# Altium schematic sheet Main.SchDoc
size 635 x 279 mm; SheetNumber: 1
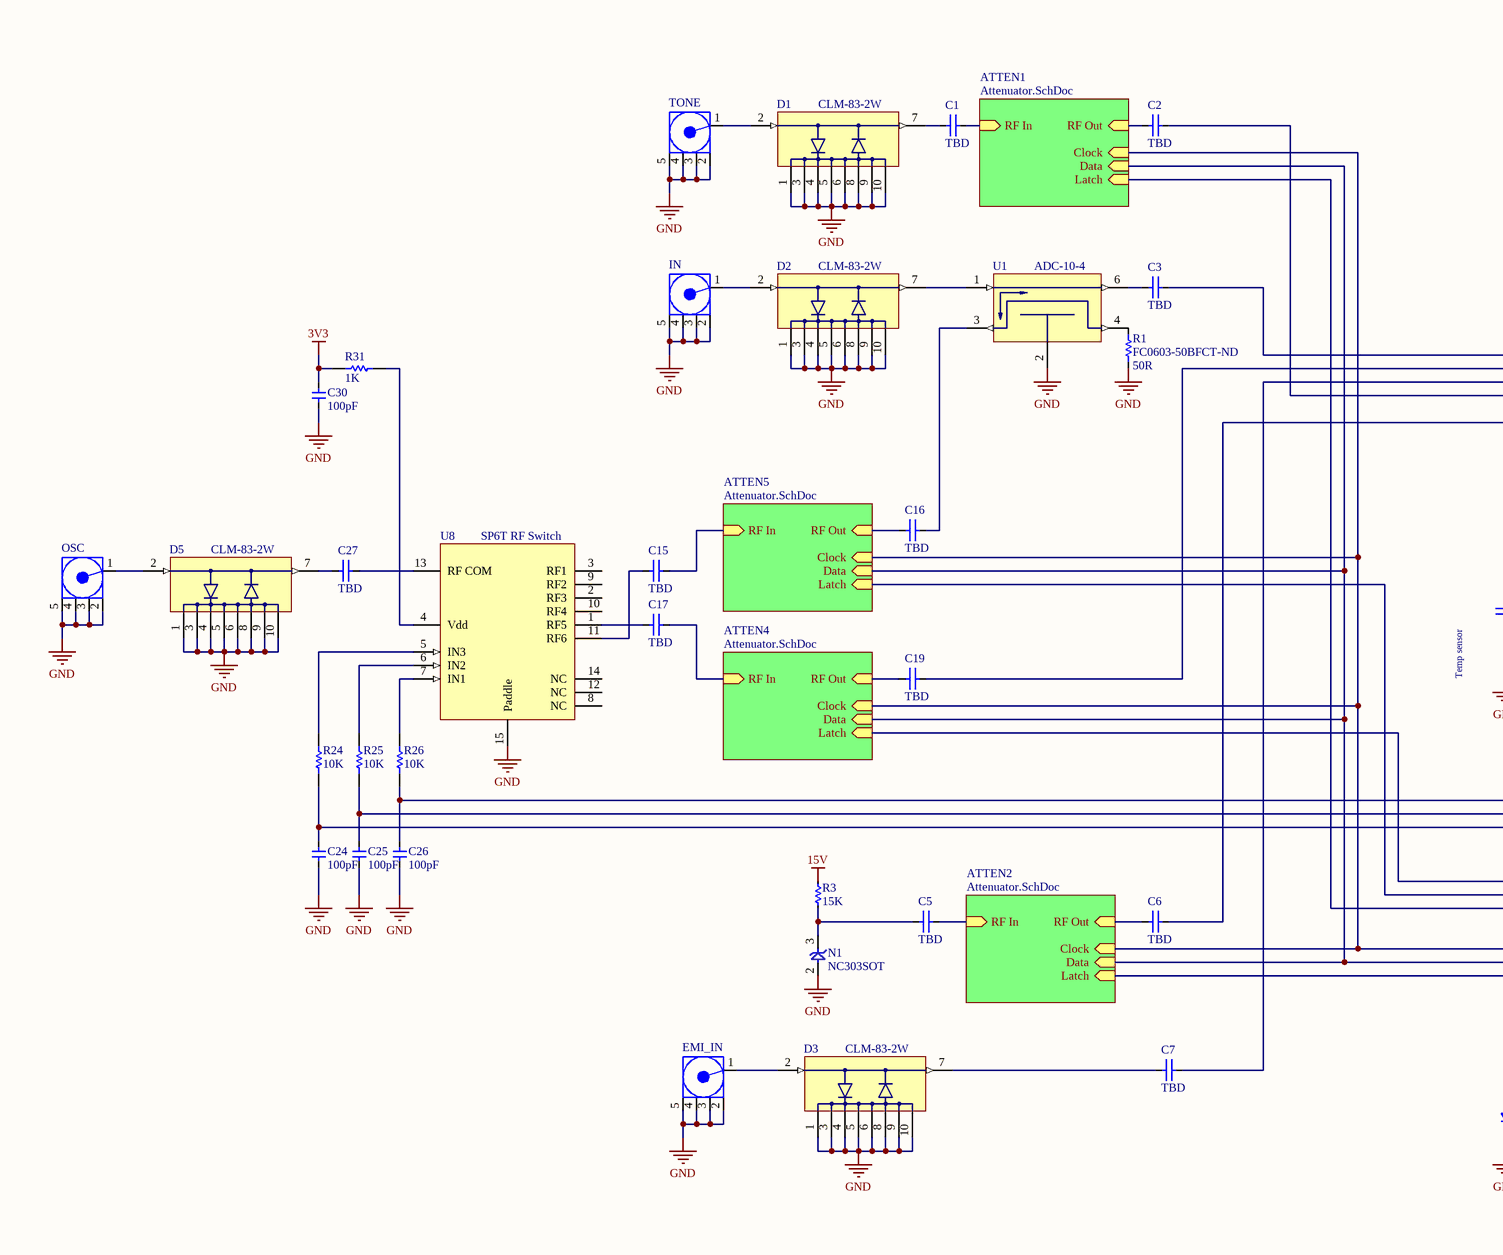
[diagram p0: Main.SchDoc, left]
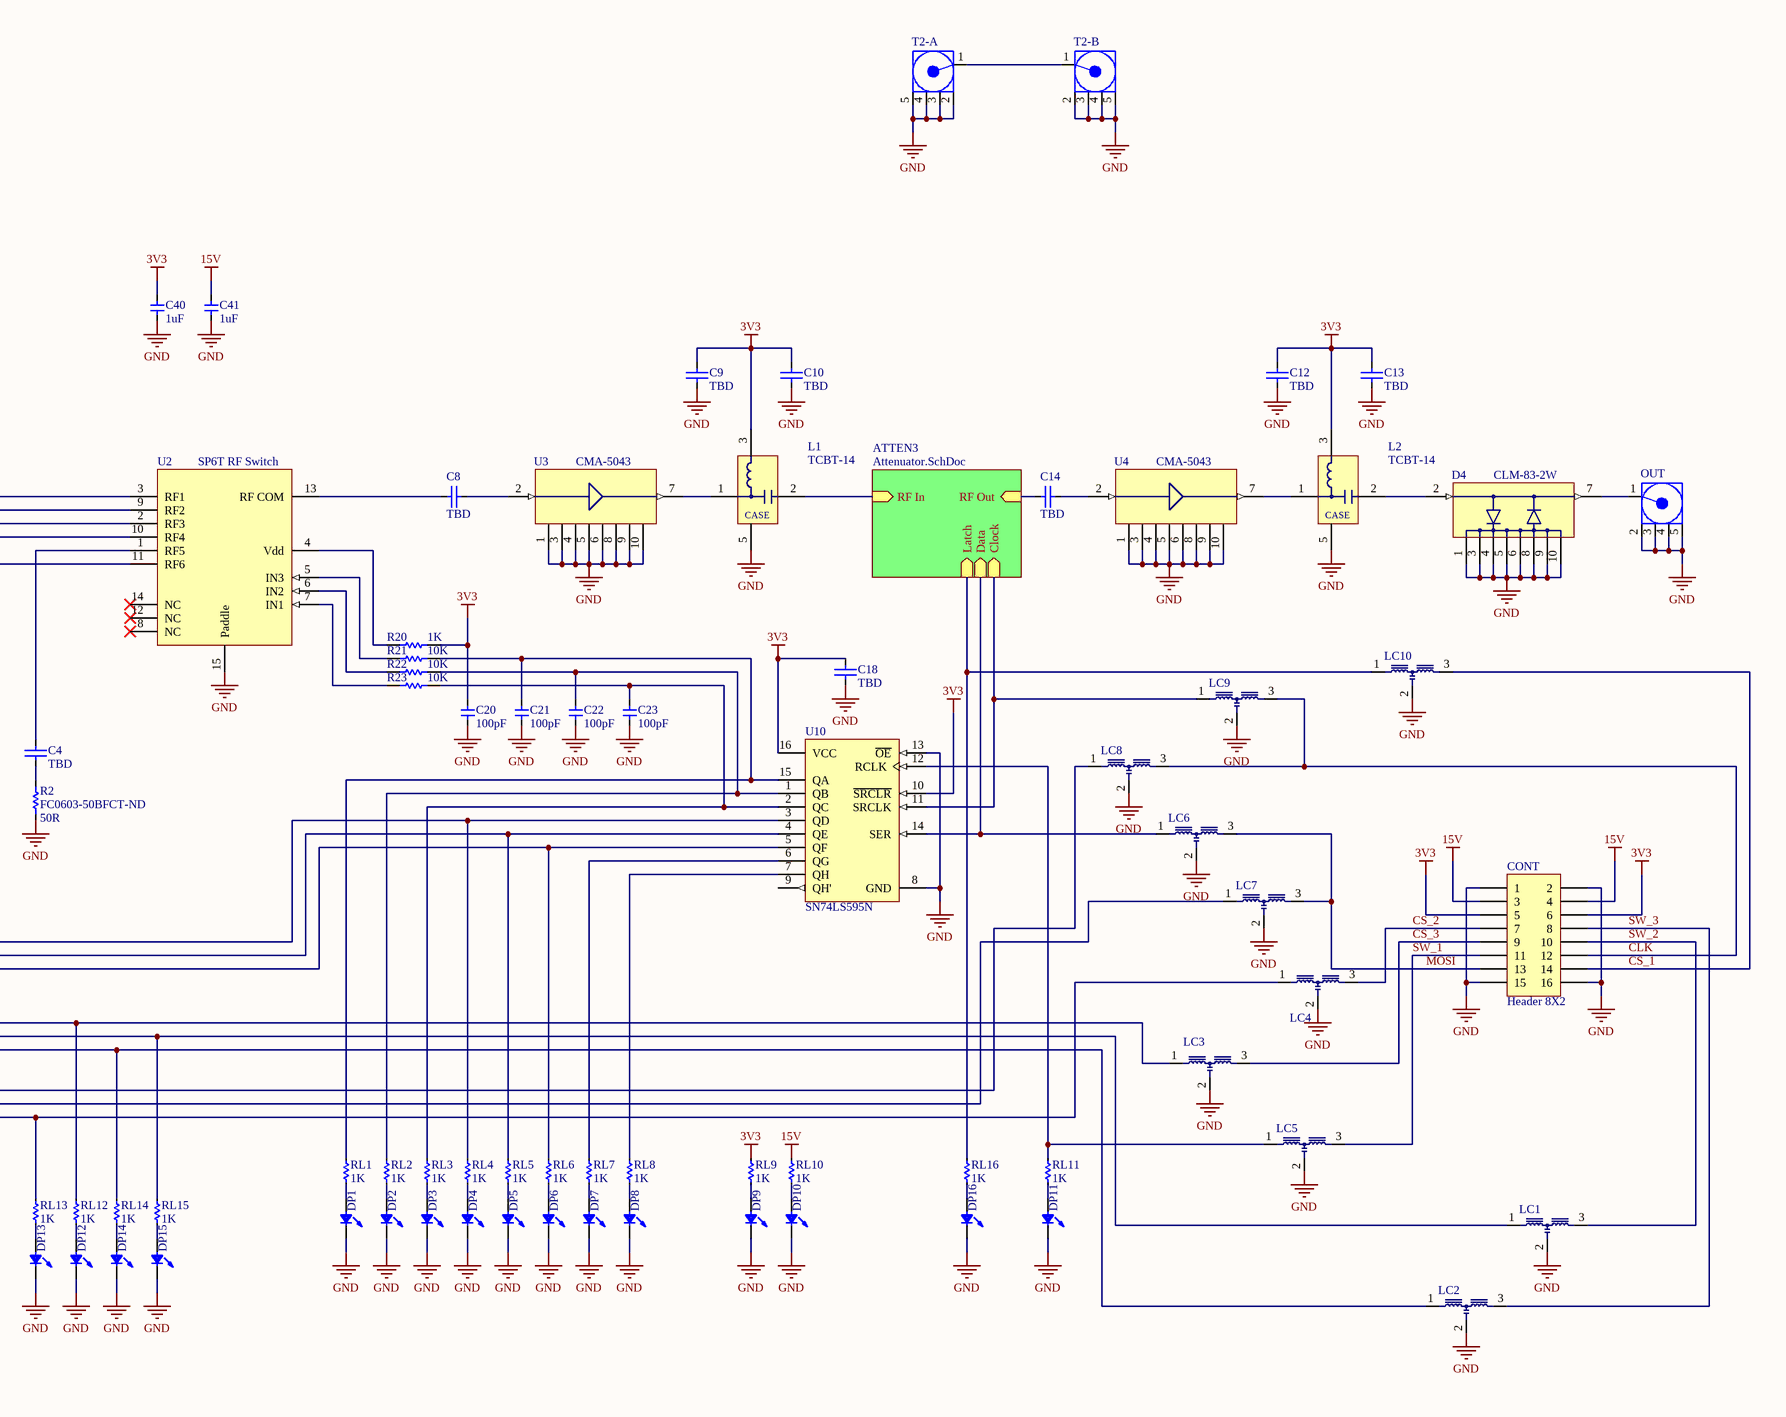
[diagram p1: Main.SchDoc, right]

## Parts
C1  value TBD  [0402C]  (hidden comment: Cap)
C2  value TBD  [0402C]  (hidden comment: Cap)
C3  value TBD  [0402C]  (hidden comment: Cap)
C4  value TBD  [0402C]  (hidden comment: Cap)
C5  value TBD  [0402C]  (hidden comment: Cap)
C6  value TBD  [0402C]  (hidden comment: Cap)
C7  value TBD  [0402C]  (hidden comment: Cap)
C8  value TBD  [0402C]  (hidden comment: Cap)
C9  value TBD  [0805C]  (hidden comment: Cap)
C10  value TBD  [0805C]  (hidden comment: Cap)
C12  value TBD  [0805C]  (hidden comment: Cap)
C13  value TBD  [0805C]  (hidden comment: Cap)
C14  value TBD  [0402C]  (hidden comment: Cap)
C15  value TBD  [0402C]  (hidden comment: Cap)
C16  value TBD  [0402C]  (hidden comment: Cap)
C17  value TBD  [0402C]  (hidden comment: Cap)
C18  value TBD  [0603C]  (hidden comment: Cap)
C19  value TBD  [0402C]  (hidden comment: Cap)
C20  value 100pF  [0603C]  (hidden comment: SMT Cap)
C21  value 100pF  [0603C]  (hidden comment: SMT Cap)
C22  value 100pF  [0603C]  (hidden comment: SMT Cap)
C23  value 100pF  [0603C]  (hidden comment: SMT Cap)
C24  value 100pF  [0603C]  (hidden comment: SMT Cap)
C25  value 100pF  [0603C]  (hidden comment: SMT Cap)
C26  value 100pF  [0603C]  (hidden comment: SMT Cap)
C27  value TBD  [0402C]  (hidden comment: Cap)
C30  value 100pF  [0603C]  (hidden comment: SMT Cap)
C40  value 1uF  [V]  (hidden comment: SMT Cap)
C41  value 1uF  [V]  (hidden comment: SMT Cap)
CONT  Header 8X2  [SMT 16-pin rectangular header]
D1  CLM-83-2W  [DL1721]
D2  CLM-83-2W  [DL1721]
D3  CLM-83-2W  [DL1721]
D4  CLM-83-2W  [DL1721]
D5  CLM-83-2W  [DL1721]
DP1  LED0  [0603 SMT LED]  (value not drawn)
DP2  LED0  [0603 SMT LED]  (value not drawn)
DP3  LED0  [0603 SMT LED]  (value not drawn)
DP4  LED0  [0603 SMT LED]  (value not drawn)
DP5  LED0  [0603 SMT LED]  (value not drawn)
DP6  LED0  [0603 SMT LED]  (value not drawn)
DP7  LED0  [0603 SMT LED]  (value not drawn)
DP8  LED0  [0603 SMT LED]  (value not drawn)
DP9  LED0  [0603 SMT LED]  (value not drawn)
DP10  LED0  [0603 SMT LED]  (value not drawn)
DP11  LED0  [0603 SMT LED]  (value not drawn)
DP12  LED0  [0603 SMT LED]  (value not drawn)
DP13  LED0  [0603 SMT LED]  (value not drawn)
DP14  LED0  [0603 SMT LED]  (value not drawn)
DP15  LED0  [0603 SMT LED]  (value not drawn)
DP16  LED0  [0603 SMT LED]  (value not drawn)
EMI_IN  COAX-M  [SMT RA SMA Connector]  (value not drawn)
IN  COAX-M  [SMT RA SMA Connector]  (value not drawn)
L1  TCBT-14  [GU1414]
L2  TCBT-14  [GU1414]
LC1  MEM2012F  [MEM2012S LC Filter]  (value not drawn)
LC2  MEM2012F  [MEM2012S LC Filter]  (value not drawn)
LC3  MEM2012F  [MEM2012S LC Filter]  (value not drawn)
LC4  MEM2012F  [MEM2012S LC Filter]  (value not drawn)
LC5  MEM2012F  [MEM2012S LC Filter]  (value not drawn)
LC6  MEM2012F  [MEM2012S LC Filter]  (value not drawn)
LC7  MEM2012F  [MEM2012S LC Filter]  (value not drawn)
LC8  MEM2012F  [MEM2012S LC Filter]  (value not drawn)
LC9  MEM2012F  [MEM2012S LC Filter]  (value not drawn)
LC10  MEM2012F  [MEM2012S LC Filter]  (value not drawn)
N1  NC303SOT  [SOT323-3AN]
OSC  COAX-M  [SMT RA SMA Connector]  (value not drawn)
OUT  COAX-M  [SMT RA SMA Connector]  (value not drawn)
R1  FC0603-50BFCT-ND  value 50R  [0603R]
R2  FC0603-50BFCT-ND  value 50R  [0603R]
R3  value 15K  [1206R]  (hidden comment: Res Semi Small)
R20  value 1K  [0603R]  (hidden comment: RES Semi)
R21  value 10K  [0603R]  (hidden comment: RES Semi)
R22  value 10K  [0603R]  (hidden comment: RES Semi)
R23  value 10K  [0603R]  (hidden comment: RES Semi)
R24  value 10K  [0603R]  (hidden comment: RES Semi)
R25  value 10K  [0603R]  (hidden comment: RES Semi)
R26  value 10K  [0603R]  (hidden comment: RES Semi)
R31  value 1K  [0603R]  (hidden comment: RES Semi)
RL1  value 1K  [0603R]  (hidden comment: Res Semi Small)
RL2  value 1K  [0603R]  (hidden comment: Res Semi Small)
RL3  value 1K  [0603R]  (hidden comment: Res Semi Small)
RL4  value 1K  [0603R]  (hidden comment: Res Semi Small)
RL5  value 1K  [0603R]  (hidden comment: Res Semi Small)
RL6  value 1K  [0603R]  (hidden comment: Res Semi Small)
RL7  value 1K  [0603R]  (hidden comment: Res Semi Small)
RL8  value 1K  [0603R]  (hidden comment: Res Semi Small)
RL9  value 1K  [0603R]  (hidden comment: Res Semi Small)
RL10  value 1K  [0603R]  (hidden comment: Res Semi Small)
RL11  value 1K  [0603R]  (hidden comment: Res Semi Small)
RL12  value 1K  [0603R]  (hidden comment: Res Semi Small)
RL13  value 1K  [0603R]  (hidden comment: Res Semi Small)
RL14  value 1K  [0603R]  (hidden comment: Res Semi Small)
RL15  value 1K  [0603R]  (hidden comment: Res Semi Small)
RL16  value 1K  [0603R]  (hidden comment: Res Semi Small)
T2-A  COAX-M  [SMT RA SMA Connector]  (value not drawn)
T2-B  COAX-M  [SMT RA SMA Connector]  (value not drawn)
TONE  COAX-M  [SMT RA SMA Connector]  (value not drawn)
U1  ADC-10-4  [CD542]
U2  SP6T RF Switch  [MT1817]
U3  CMA-5043  [DL1721]
U4  CMA-5043  [DL1721]
U8  SP6T RF Switch  [MT1817]
U10  SN74LS595N  [SOIC127P602-16BN]

## Sub-sheets
ATTEN1 = Attenuator.SchDoc: RF In (in), RF Out (in), Clock (in), Data (in), Latch (in)
ATTEN2 = Attenuator.SchDoc: RF In (in), RF Out (in), Clock (in), Data (in), Latch (in)
ATTEN3 = Attenuator.SchDoc: RF In (in), RF Out (in), Clock (in), Data (in), Latch (in)
ATTEN4 = Attenuator.SchDoc: RF In (in), RF Out (in), Clock (in), Data (in), Latch (in)
ATTEN5 = Attenuator.SchDoc: RF In (in), RF Out (in), Clock (in), Data (in), Latch (in)

## Nets
3V3: C9.2 C10.2 C12.2 C13.2 C18.2 C20.2 C30.2 C40.1 CONT.5 CONT.6 L1.3(DC) L2.3(DC) R20.2 R31.2 RL9.1 U10.10(~{SRCLR}) U10.16(VCC)
15V: C41.1 CONT.3 CONT.4 R3.2 RL10.1
GND: C9.1 C10.1 C12.1 C13.1 C18.1 C20.1 C21.1 C22.1 C23.1 C24.1 C25.1 C26.1 C30.1 C40.2 C41.2 CONT.1 CONT.2 CONT.15 CONT.16 D1.1(Gnd) D1.3(Gnd) D1.4(Gnd) D1.5(Gnd) D1.6(Gnd) D1.8(Gnd) D1.9(Gnd) D1.10(Gnd) D2.1(Gnd) D2.3(Gnd) D2.4(Gnd) D2.5(Gnd) D2.6(Gnd) D2.8(Gnd) D2.9(Gnd) D2.10(Gnd) D3.1(Gnd) D3.3(Gnd) D3.4(Gnd) D3.5(Gnd) D3.6(Gnd) D3.8(Gnd) D3.9(Gnd) D3.10(Gnd) D4.1(Gnd) D4.3(Gnd) D4.4(Gnd) D4.5(Gnd) D4.6(Gnd) D4.8(Gnd) D4.9(Gnd) D4.10(Gnd) D5.1(Gnd) D5.3(Gnd) D5.4(Gnd) D5.5(Gnd) D5.6(Gnd) D5.8(Gnd) D5.9(Gnd) D5.10(Gnd) DP1.2 DP2.2 DP3.2 DP4.2 DP5.2 DP6.2 DP7.2 DP8.2 DP9.2 DP10.2 DP11.2 DP12.2 DP13.2 DP14.2 DP15.2 DP16.2 EMI_IN.2(GND) EMI_IN.3(GND) EMI_IN.4(GND) EMI_IN.5(GND) IN.2(GND) IN.3(GND) IN.4(GND) IN.5(GND) L1.5(CASE) L2.5(CASE) LC1.2 LC2.2 LC3.2 LC4.2 LC5.2 LC6.2 LC7.2 LC8.2 LC9.2 LC10.2 N1.2(A) OSC.2(GND) OSC.3(GND) OSC.4(GND) OSC.5(GND) OUT.2(GND) OUT.3(GND) OUT.4(GND) OUT.5(GND) R1.1 R2.1 T2-A.2(GND) T2-A.3(GND) T2-A.4(GND) T2-A.5(GND) T2-B.2(GND) T2-B.3(GND) T2-B.4(GND) T2-B.5(GND) TONE.2(GND) TONE.3(GND) TONE.4(GND) TONE.5(GND) U1.2(Gnd) U2.15(Paddle) U3.1(Gnd) U3.3(Gnd) U3.4(Gnd) U3.5(Gnd) U3.6(Gnd) U3.8(Gnd) U3.9(Gnd) U3.10(Gnd) U4.1(Gnd) U4.3(Gnd) U4.4(Gnd) U4.5(Gnd) U4.6(Gnd) U4.8(Gnd) U4.9(Gnd) U4.10(Gnd) U8.15(Paddle) U10.8(GND) U10.13(~{OE})
CLK: CONT.12 LC8.3 LC9.3
CS_1: CONT.14 LC10.3
CS_2: CONT.7 LC4.3
CS_3: CONT.9 LC3.3
MOSI: CONT.13 LC6.3 LC7.3
SW_1: CONT.11 LC5.3
SW_2: CONT.10 LC1.3
SW_3: CONT.8 LC2.3
NetC1_1: C1.1 D1.7(Gnd)
NetC1_2: C1.2 ; sheet ATTEN1/RF In
NetC2_1: C2.1 ; sheet ATTEN1/RF Out
NetC2_2: C2.2 U2.10(RF4)
NetC3_1: C3.1 U1.6(Output)
NetC3_2: C3.2 U2.3(RF1)
NetC4_1: C4.1 R2.2
NetC4_2: C4.2 U2.1(RF5)
NetC5_1: C5.1 N1.3(C) R3.1
NetC5_2: C5.2 ; sheet ATTEN2/RF In
NetC6_1: C6.1 ; sheet ATTEN2/RF Out
NetC6_2: C6.2 U2.11(RF6)
NetC7_1: C7.1 D3.7(Gnd)
NetC7_2: C7.2 U2.2(RF3)
NetC8_1: C8.1 U2.13(RF_COM)
NetC8_2: C8.2 U3.2(In)
NetC14_1: C14.1 ; sheet ATTEN3/RF Out
NetC14_2: C14.2 U4.2(In)
NetC15_1: C15.1 U8.11(RF6)
NetC15_2: C15.2 ; sheet ATTEN5/RF In
NetC16_1: C16.1 ; sheet ATTEN5/RF Out
NetC16_2: C16.2 U1.3(Coupled)
NetC17_1: C17.1 U8.1(RF5)
NetC17_2: C17.2 ; sheet ATTEN4/RF In
NetC19_1: C19.1 ; sheet ATTEN4/RF Out
NetC19_2: C19.2 U2.9(RF2)
NetC21_2: C21.2 R21.2 RL1.1 U10.15(QA)
NetC22_2: C22.2 R22.2 RL2.1 U10.1(QB)
NetC23_2: C23.2 R23.2 RL3.1 U10.2(QC)
NetC24_2: C24.2 R24.1 RL6.1 U10.5(QF)
NetC25_2: C25.2 R25.1 RL5.1 U10.4(QE)
NetC26_2: C26.2 R26.1 RL4.1 U10.3(QD)
NetC27_1: C27.1 D5.7(Gnd)
NetC27_2: C27.2 U8.13(RF_COM)
NetD1_2: D1.2(In) TONE.1(Signal)
NetD2_2: D2.2(In) IN.1(Signal)
NetD2_7: D2.7(Gnd) U1.1(Input)
NetD3_2: D3.2(In) EMI_IN.1(Signal)
NetD4_2: D4.2(In) L2.2(RF)
NetD4_7: D4.7(Gnd) OUT.1(Signal)
NetD5_2: D5.2(In) OSC.1(Signal)
NetDP1_1: DP1.1 RL1.2
NetDP2_1: DP2.1 RL2.2
NetDP3_1: DP3.1 RL3.2
NetDP4_1: DP4.1 RL4.2
NetDP5_1: DP5.1 RL5.2
NetDP6_1: DP6.1 RL6.2
NetDP7_1: DP7.1 RL7.2
NetDP8_1: DP8.1 RL8.2
NetDP9_1: DP9.1 RL9.2
NetDP10_1: DP10.1 RL10.2
NetDP11_1: DP11.1 RL11.2
NetDP12_1: DP12.1 RL12.2
NetDP13_1: DP13.1 RL13.2
NetDP14_1: DP14.1 RL14.2
NetDP15_1: DP15.1 RL15.2
NetDP16_1: DP16.1 RL16.2
NetL1_1: L1.1(RF+DC) U3.7(Gnd)
NetL1_2: L1.2(RF) ; sheet ATTEN3/RF In
NetL2_1: L2.1(RF+DC) U4.7(Gnd)
NetLC1_1: LC1.1 RL15.1 ; sheet ATTEN5/Latch
NetLC2_1: LC2.1 RL14.1 ; sheet ATTEN1/Latch
NetLC3_1: LC3.1 RL12.1 ; sheet ATTEN4/Latch
NetLC4_1: LC4.1 RL13.1 ; sheet ATTEN2/Latch
NetLC5_1: LC5.1 RL11.1 U10.12(RCLK)
NetLC6_1: LC6.1 U10.14(SER) ; sheet ATTEN3/Data
NetLC7_1: LC7.1 ; sheet ATTEN1/Data, sheet ATTEN2/Data, sheet ATTEN4/Data, sheet ATTEN5/Data
NetLC8_1: LC8.1 ; sheet ATTEN1/Clock, sheet ATTEN2/Clock, sheet ATTEN4/Clock, sheet ATTEN5/Clock
NetLC9_1: LC9.1 U10.11(SRCLK) ; sheet ATTEN3/Clock
NetLC10_1: LC10.1 RL16.1 ; sheet ATTEN3/Latch
NetR1_2: R1.2 U1.4(Termination)
NetR20_1: R20.1 U2.4(Vdd)
NetR21_1: R21.1 U2.5(IN3)
NetR22_1: R22.1 U2.6(IN2)
NetR23_1: R23.1 U2.7(IN1)
NetR24_2: R24.2 U8.5(IN3)
NetR25_2: R25.2 U8.6(IN2)
NetR26_2: R26.2 U8.7(IN1)
NetR31_1: R31.1 U8.4(Vdd)
NetRL7_1: RL7.1 U10.6(QG)
NetRL8_1: RL8.1 U10.7(QH)
NetT2-A_1: T2-A.1(Signal) T2-B.1(Signal)

Not connected (* = marked no-connect by the designer): L1 4(NC); L2 4(NC); U1 5(DNC); U2 8(NC)* 12(NC)* 14(NC)*; U8 2(RF3) 3(RF1) 8(NC) 9(RF2) 10(RF4) 12(NC) 14(NC); U10 9(QH')

## Notes on the sheet
- Temp sensor
- Title
- Size:
- Date:
- Tabloid
- Number:
- Time:
- Revision:
- Sheet
- of
- File:

## Library data of the parts
C1-C10 C12-C19 C27 = Cap: Capacitor; Published: 8-Jun-2000; LatestRevisionDate: 17-Jul-2002; LatestRevisionNote: Re-released for DXP Platform.; PackageReference: RAD-0.3; Publisher: Altium Limited
C20-C26 C30 C40 C41 = Cap - SMT Small: Published: 8-Jun-2000; LatestRevisionDate: 29-May-2009; LatestRevisionNote: IPC-7351 Footprint Added.; PackageReference: C1206; Publisher: Altium Limited; PackageDescription: Chip Capacitor
CONT = Header 8X2: Header, 8-Pin, Dual row; LatestRevisionDate: 17-Jul-2002; LatestRevisionNote: Re-released for DXP Platform.; Publisher: Altium Limited
D1-D5 = CLM-83-2W: +12 to +32 dBm RF Limiter
DP1-DP16 = LED0: T 1 3/4 LED; Published: 8-Jun-2000; LatestRevisionDate: 08-Jul-2005; LatestRevisionNote: Mech Layer 1 removed.; PackageReference: LED-0; Publisher: Altium Limited
EMI_IN IN OSC OUT T2-A T2-B TONE = COAX-M: RF Coaxial PCB Connector, MMCX; Thru-Hole, Vertical Mount Plug,  50 Ohm Impedance; PackageDocument: Rev. A, 16-Jun-1997; PCB_Layout: Complies with manufacturer's recommendation.; DrillSize: Corresponds to nominal value.; Published: 15-Jul-2004; LatestRevisionDate: 15-Jul-2004; LatestRevisionNote: Component Replaced.; DatasheetDocument: 30-May-2003; PackageReference: 908-21103; Publisher: Altium Limited; ComponentLink1Description: Manufacturer Link; ComponentLink1URL: http://www.amphenolrf.com/
L1 L2 = TCBT-14: Surface Mount 10 MHz to 10 GHz Bias Tee
LC1-LC10 = MEM2012F - Signal Filter: Signal Line 3-terminal Filters
N1 = NC303SOT: SMT Noise Diode
R1 R2 = RES Semi: Published: 8-Jun-2000; LatestRevisionDate: 17-Jul-2002; LatestRevisionNote: Re-released for DXP Platform.; PackageReference: AXIAL-0.5; Publisher: Altium Limited
R3 RL1-RL16 = Res Semi Small: Semiconductor Resistor; Published: 8-Jun-2000; LatestRevisionDate: 17-Jul-2002; LatestRevisionNote: Re-released for DXP Platform.; PackageReference: AXIAL-0.5; Publisher: Altium Limited
R20-R26 R31 = RES Semi: Semiconductor Resistor; Published: 8-Jun-2000; LatestRevisionDate: 17-Jul-2002; LatestRevisionNote: Re-released for DXP Platform.; PackageReference: AXIAL-0.5; Publisher: Altium Limited
U1 = ADC-10-4: Surface Mount Directional Coupler
U2 U8 = JSW6-33DR+: SP6T RF Switch 50Ω 10 to 2700 MHz
U3 U4 = CMA-5043: Low Noise, High IP3 Monolithic Amplifier
U10 = SN74LS595N: 8-Bit Shift Register with Output Latch; Published: 8-Jun-2000; LatestRevisionDate: 04-Mar-2005; LatestRevisionNote: Stylized 3D Model Added.; DatasheetVersion: Mar-1988; PackageVersion: Oct-1995; PackageReference: N016; Publisher: Altium Limited; PackageDescription: DIP; 16 Leads; Row Spacing 7.62 mm; Pitch 2.54 mm; Code_JEDEC: MS-001-BB; ComponentLink1Description: Manufacturer Link; ComponentLink1URL: http://www.ti.com/; ComponentLink2Description: Datasheet; ComponentLink2URL: http://www-s.ti.com/sc/ds/sn74ls596.pdf